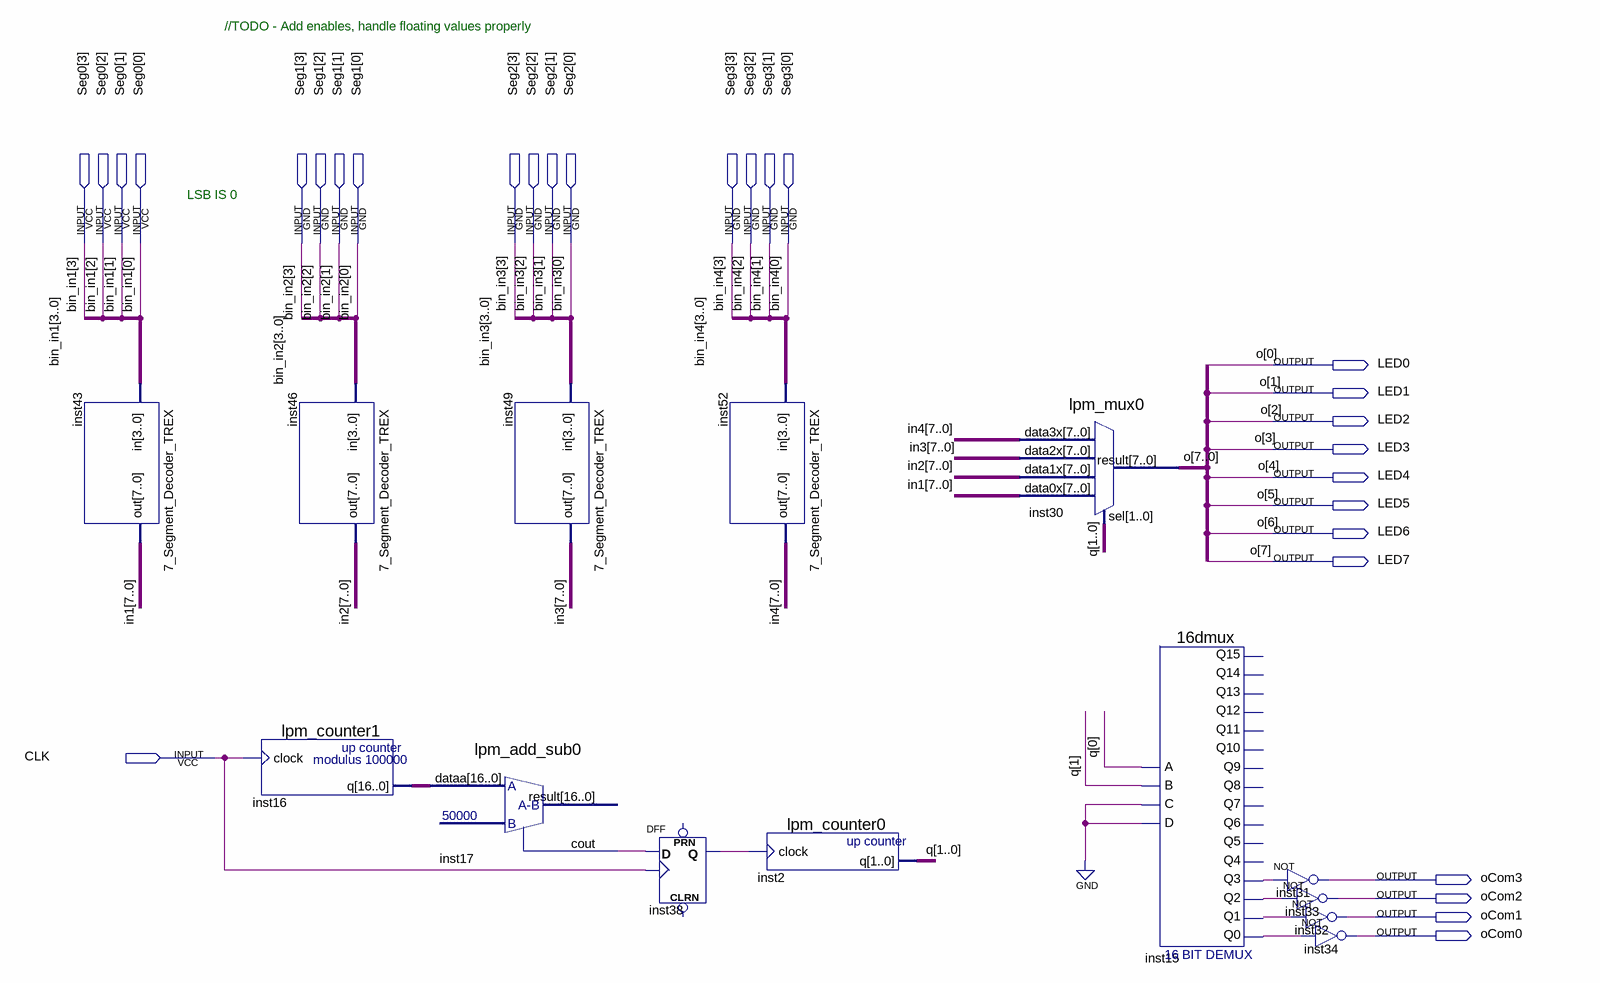
[diagram p0: schematic sheet]
// Quartus schematic MultiPlexed7Seg.bdf as structural Verilog: 14 symbols, 29 pins
module MultiPlexed7Seg (
  input  [3:0] Seg0,
  input  [3:0] Seg1,
  input  [3:0] Seg2,
  input  [3:0] Seg3,
  input  CLK,
  output LED0,
  output LED1,
  output LED2,
  output LED3,
  output LED4,
  output LED5,
  output LED6,
  output LED7,
  output oCom3,
  output oCom2,
  output oCom1,
  output oCom0
);

  wire inst15_q0, inst15_q1, inst15_q2, inst15_q3, inst17_cout, inst38_q;
  wire [1:0] q;
  wire [7:0] in1, in2, in3, in4;
  wire [16:0] inst16_q;

  \7_Segment_Decoder_TREX  inst43 (.in(Seg0), .out(in1));
  \7_Segment_Decoder_TREX  inst46 (.in(Seg1), .out(in2));
  lpm_counter1 inst16 (.clock(CLK), .q(inst16_q));
  lpm_add_sub0 inst17 (.dataa(inst16_q), .cout(inst17_cout));  // open: result
  \7_Segment_Decoder_TREX  inst49 (.in(Seg2), .out(in3));
  DFF inst38 (.CLK(CLK), .D(inst17_cout), .Q(inst38_q));  // open: CLRN, PRN
  \7_Segment_Decoder_TREX  inst52 (.in(Seg3), .out(in4));
  lpm_counter0 inst2 (.clock(inst38_q), .q(q));
  lpm_mux0 inst30 (
    .data3x(in4), .data2x(in3), .data1x(in2), .data0x(in1), .sel(q),
    .result({LED7, LED6, LED5, LED4, LED3, LED2, LED1, LED0}));
  \16dmux  inst15 (
    .C(1'b0), .B(q[1]), .A(q[0]), .D(1'b0), .Q2(inst15_q2), .Q3(inst15_q3), .Q0(inst15_q0), .Q1(inst15_q1));  // open: Q12, Q13, Q11, Q9, Q10, Q7, Q8, Q4, Q5, Q6, Q14, Q15
  not inst31 (oCom3, inst15_q3);
  not inst33 (oCom2, inst15_q2);
  not inst32 (oCom1, inst15_q1);
  not inst34 (oCom0, inst15_q0);

  // Other names for the same wires on the sheet: bin_in1[3:0] = Seg0; bin_in2[3:0] = Seg1; bin_in3[3:0] = Seg2;
  //   bin_in4[3:0] = Seg3; o[7:0] = {LED7, LED6, LED5, LED4, LED3, LED2, LED1, LED0}

  // Notes on the sheet:
  //   //TODO - Add enables, handle floating values properly
  //   LSB IS 0
endmodule
